# EAGLE schematic main_board (EAGLE 6.1)
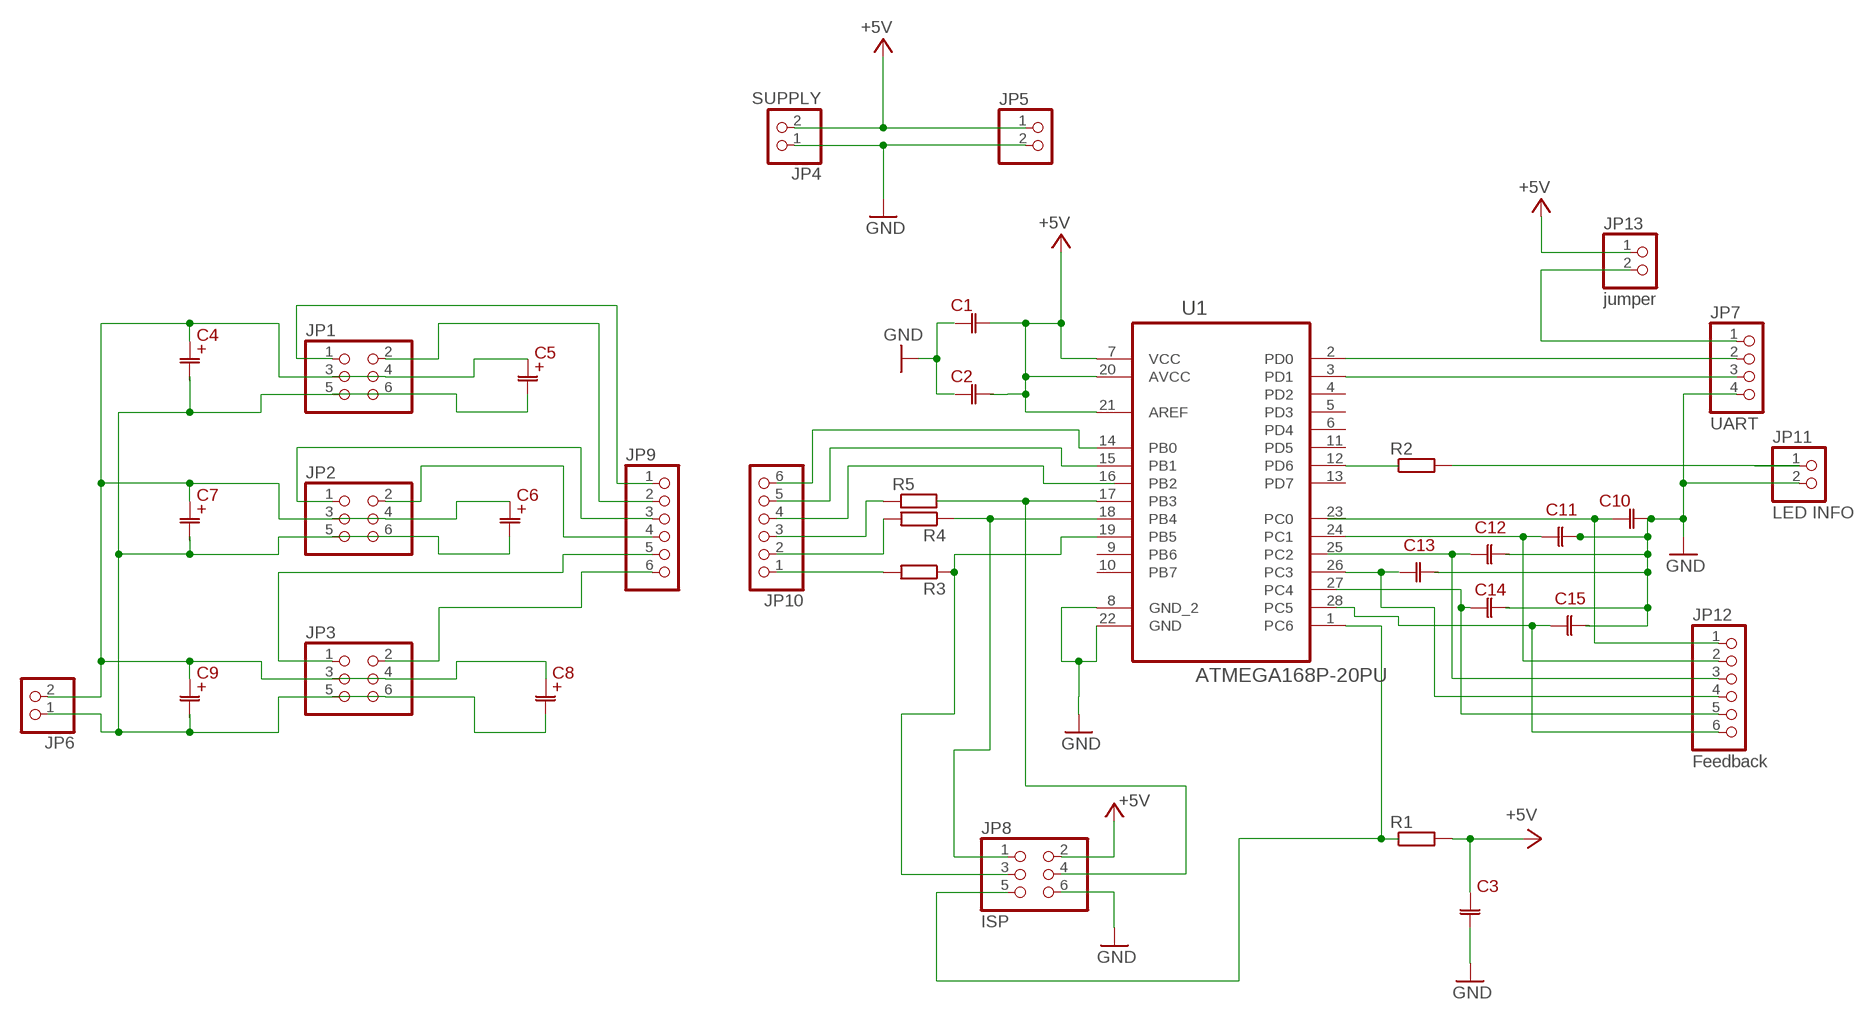
[diagram p0: schematic, sheet 1]

## Parts
C1  C-UA  [C2225K]
C2  C-UA  [C2225K]
C3  C-UA  [C2225K]
C4  CPOL-UA  [E3,5-8]
C5  CPOL-UA  [E3,5-8]
C6  CPOL-UA  [E3,5-8]
C7  CPOL-UA  [E3,5-8]
C8  CPOL-UA  [E3,5-8]
C9  CPOL-UA  [E3,5-8]
C10  C-UA  [C2225K]
C11  C-UA  [C2225K]
C12  C-UA  [C2225K]
C13  C-UA  [C2225K]
C14  C-UA  [C2225K]
C15  C-UA  [C2225K]
JP1  PINHD-2X3  [2X03]
JP2  PINHD-2X3  [2X03]
JP3  PINHD-2X3  [2X03]
JP4  SUPPLY  PINHD-1X2  [1X02]
JP5  PINHD-1X2  [1X02]
JP6  PINHD-1X2  [1X02]
JP7  UART  PINHD-1X4  [1X04]
JP8  ISP  PINHD-2X3  [2X03]
JP9  PINHD-1X6  [1X06]
JP10  PINHD-1X6  [1X06]
JP11  LED INFO  PINHD-1X2  [1X02]
JP12  Feedback  PINHD-1X6  [1X06]
JP13  jumper  PINHD-1X2  [1X02]
R1  R-EU_0204/2V  [0204V]
R2  R-EU_0204/2V  [0204V]
R3  R-EU_0204/2V  [0204V]
R4  R-EU_0204/2V  [0204V]
R5  R-EU_0204/2V  [0204V]
U1  ATMEGA168P-20PU  [DIP254P762X457-28]

## Nets
+5V: JP4.2 JP5.1 JP8.2 JP13.1 R1.2 U1.7(VCC) U1.20(AVCC) U1.21(AREF)
GND: C3.2 C10.2 C11.2 C12.2 C13.2 C14.2 C15.2 JP4.1 JP5.2 JP7.4 JP8.6 JP11.2 U1.8(GND_2) U1.22(GND)
N$1: JP7.1 JP13.2
N$2: JP8.3 R3.1 U1.19(PB5)
N$3: JP10.2 R4.2
N$5: JP1.3 JP1.4 JP2.3 JP2.4 JP3.3 JP3.4 JP6.2
N$6: C4.- JP1.5 JP1.6 JP2.5 JP2.6 JP3.5 JP3.6 JP6.1
N$7: JP8.1 R4.1 U1.18(PB4)
N$8: JP10.3 R5.1
N$9: JP8.4 U1.17(PB3)
N$10: JP10.4
N$11: JP10.5 U1.15(PB1)
N$12: JP10.6 U1.14(PB0)
N$13: JP1.1 JP9.1
N$14: JP1.2 JP9.2
N$15: JP2.1 JP9.3
N$16: JP2.2 JP9.4
N$17: JP3.1 JP9.5
N$18: JP3.2 JP9.6
N$19: JP10.1 R3.2
N$20: JP8.5 R1.1 U1.1(PC6)
N$21: JP11.1 R2.2
N$22: JP12.5
N$23: JP7.2 U1.2(PD0)
N$24: JP7.3 U1.3(PD1)
N$25: R2.1 U1.12(PD6)
N$26: JP12.1
N$27: JP12.2 U1.24(PC1)
N$28: JP12.3
N$29: JP12.6
N$30: JP12.4 U1.26(PC3)
Unconnected: C1.1 C1.2 C2.1 C2.2 C3.1 C4.+ C5.+ C5.- C6.+ C6.- C7.+ C7.- C8.+ C8.- C9.+ C9.- C10.1 C11.1 C12.1 C13.1 C14.1 C15.1 R5.2 U1.4(PD2) U1.5(PD3) U1.6(PD4) U1.9(PB6) U1.10(PB7) U1.11(PD5) U1.13(PD7) U1.16(PB2) U1.23(PC0) U1.25(PC2) U1.27(PC4) U1.28(PC5)

## Library data of the parts
C1-C3 C10-C15 = resistor:C-UA
C4-C9 = resistor:CPOL-UA
JP1-JP3 JP8 = pinhead:PINHD-2X3: PIN HEADER
JP4-JP6 JP11 JP13 = pinhead:PINHD-1X2: PIN HEADER
JP7 = pinhead:PINHD-1X4: PIN HEADER
JP9 JP10 JP12 = pinhead:PINHD-1X6: PIN HEADER
R1-R5 = resistor:R-EU_: RESISTOR, European symbol
U1 = Atmel_By_element14_Batch_1:ATMEGA168P-20PU: 8-bit Microcontroller with In-System Programmable Flash; MPN: ATMEGA168P-20PU; OC_FARNELL: 1636933; OC_NEWARK: 03P2021; PACKAGE: PDIP-28; SUPPLIER: Atmel